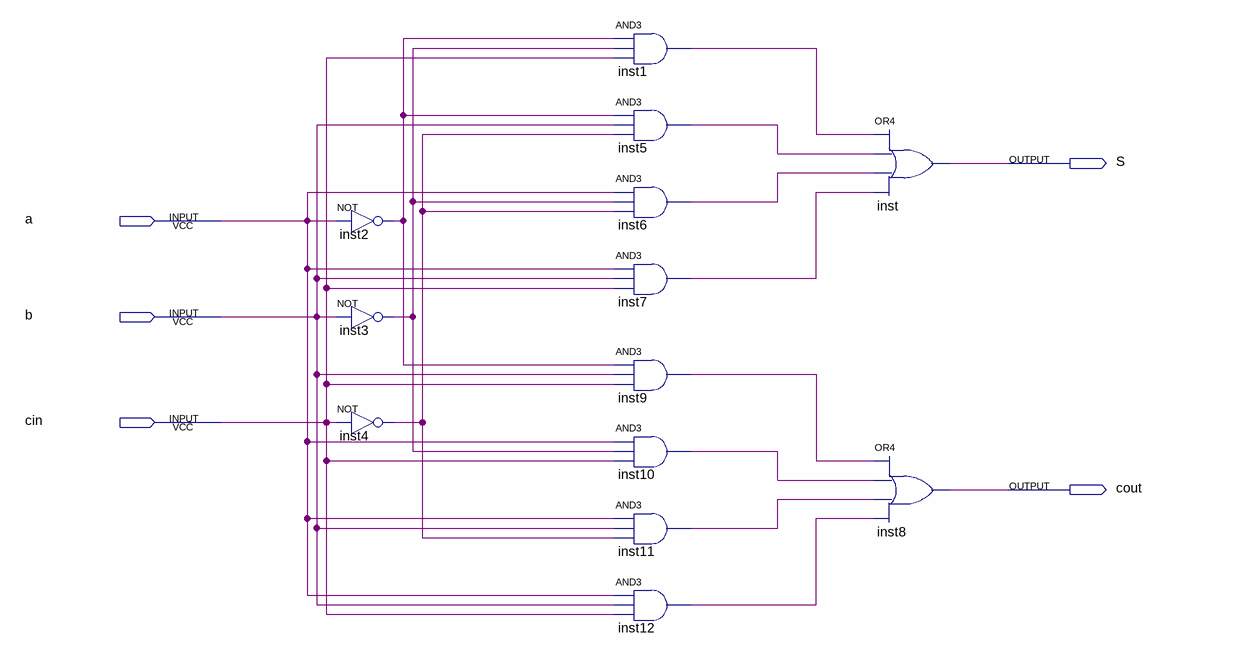
[diagram p0: schematic sheet]
// Quartus schematic p005.bdf as structural Verilog: 13 symbols, 5 pins
module p005 (
  input  a,
  input  b,
  input  cin,
  output S,
  output cout
);

  wire inst1_out, inst2_out, inst3_out, inst4_out, inst5_out, inst6_out, inst7_out, inst9_out, inst10_out,
       inst11_out, inst12_out;

  not inst2 (inst2_out, a);
  not inst3 (inst3_out, b);
  not inst4 (inst4_out, cin);
  and inst1 (inst1_out, inst2_out, inst3_out, cin);
  and inst5 (inst5_out, inst2_out, b, inst4_out);
  and inst6 (inst6_out, a, inst3_out, inst4_out);
  and inst7 (inst7_out, a, b, cin);
  and inst9 (inst9_out, inst2_out, b, cin);
  and inst10 (inst10_out, a, inst3_out, cin);
  and inst11 (inst11_out, a, b, inst4_out);
  and inst12 (inst12_out, a, b, cin);
  or inst (S, inst1_out, inst5_out, inst6_out, inst7_out);
  or inst8 (cout, inst9_out, inst10_out, inst11_out, inst12_out);
endmodule
